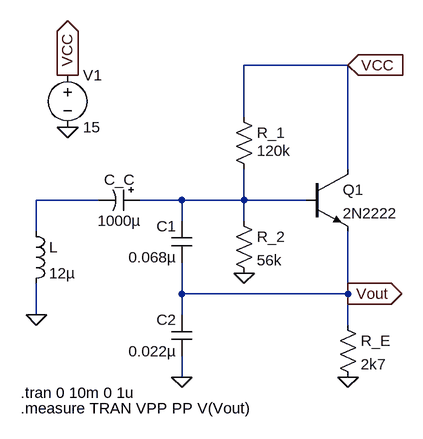
[diagram p0: schematic PROYEK-2_SIM.asc]
PROYEK-2_SIM.asc, the LTspice schematic file:
Version 4
SHEET 1 880 680
WIRE 544 -128 384 -128
WIRE 384 -48 384 -128
WIRE 544 32 544 -128
WIRE 160 80 64 80
WIRE 288 80 224 80
WIRE 384 80 384 32
WIRE 384 80 288 80
WIRE 480 80 384 80
WIRE 288 112 288 80
WIRE 384 112 384 80
WIRE 64 128 64 80
WIRE 288 224 288 176
WIRE 544 224 544 128
WIRE 544 224 288 224
WIRE 64 256 64 208
WIRE 288 256 288 224
WIRE 544 272 544 224
WIRE 288 352 288 320
FLAG 544 -128 VCC
IOPIN 544 -128 In
FLAG 384 192 0
FLAG 64 256 0
FLAG 544 352 0
FLAG 288 352 0
FLAG 112 -112 VCC
IOPIN 112 -112 Out
FLAG 544 224 Vout
IOPIN 544 224 Out
FLAG 112 -32 0
SYMBOL ind 48 112 R0
SYMATTR InstName L
SYMATTR Value 12µ
SYMBOL polcap 224 64 R90
WINDOW 0 0 32 VBottom 2
WINDOW 3 32 32 VTop 2
SYMATTR InstName C_C
SYMATTR Value 1000µ
SYMATTR Description Capacitor
SYMATTR Type cap
SYMATTR SpiceLine V=50 Irms=890m Rser=0.068 Lser=25n
SYMBOL cap 304 176 R180
WINDOW 0 24 56 Left 2
WINDOW 3 24 8 Left 2
SYMATTR InstName C1
SYMATTR Value 0.068µ
SYMATTR SpiceLine V=100 Irms=0 Rser=0 Lser=0
SYMBOL cap 304 320 R180
WINDOW 0 24 56 Left 2
WINDOW 3 24 8 Left 2
SYMATTR InstName C2
SYMATTR Value 0.022µ
SYMATTR SpiceLine V=100 Irms=0 Rser=0 Lser=0
SYMBOL res 528 256 R0
SYMATTR InstName R_E
SYMATTR Value 2k7
SYMBOL res 368 96 R0
SYMATTR InstName R_2
SYMATTR Value 56k
SYMBOL res 368 -64 R0
WINDOW 3 36 68 Left 2
SYMATTR Value 120k
SYMATTR InstName R_1
SYMBOL npn 480 32 R0
SYMATTR InstName Q1
SYMATTR Value 2N2222
SYMBOL voltage 112 -128 R0
WINDOW 123 0 0 Left 0
WINDOW 39 0 0 Left 0
SYMATTR InstName V1
SYMATTR Value 15
TEXT 40 376 Left 2 !.tran 0 10m 0 1u
TEXT 40 400 Left 2 !.measure TRAN VPP PP V(Vout)

The netlist it stands for:
* PROYEK-2_SIM.asc
L N001 0 12µ
C_C N002 N001 1000µ V=50 Irms=890m Rser=0.068 Lser=25n
C1 Vout N002 0.068µ V=100 Irms=0 Rser=0 Lser=0
C2 0 Vout 0.022µ V=100 Irms=0 Rser=0 Lser=0
R_E Vout 0 2k7
R_2 N002 0 56k
R_1 VCC N002 120k
Q1 VCC N002 Vout 0 2N2222
V1 VCC 0 15
.model NPN NPN
.model PNP PNP
.lib standard.bjt
.tran 0 10m 0 1u
.measure TRAN VPP PP V(Vout)
.backanno
.end